# Altium schematic sheet io.SchDoc
size A3
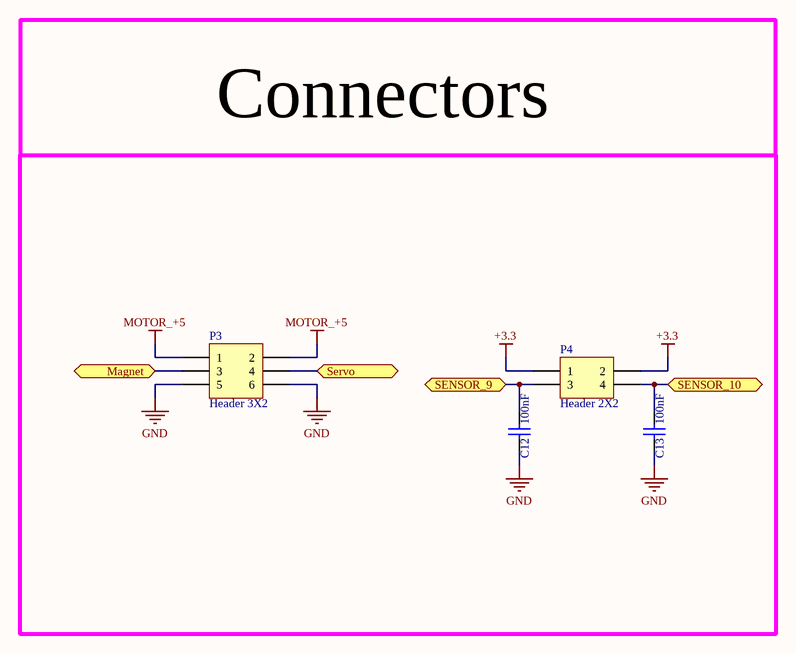
[diagram p0: io.SchDoc]

## Parts
C12  100nF  [CAP_0402i_1005m -N]
C13  100nF  [CAP_0402i_1005m -N]
P3  Header 3X2  [HDR2X3]
P4  Header 2X2  [HDR2X2]

## Ports
Magnet (bidir), SENSOR_9 (bidir), SENSOR_10 (bidir), Servo (bidir)

## Nets
+3.3: P4.1 P4.2
GND: C12.1 C13.1 P3.5 P3.6
MOTOR_+5: P3.1 P3.2
Magnet: P3.3 ; port Magnet
SENSOR_9: C12.2 P4.3 ; port SENSOR_9
SENSOR_10: C13.2 P4.4 ; port SENSOR_10
Servo: P3.4 ; port Servo

## Notes on the sheet
- Connectors
- 1
- 2
- 3
- 4
- 5
- 6
- 7
- 8
- A
- B
- C
- D
- Project:
- Date:
- Drawing number:
- Rev:
- Format:
- A3
- Drawn by:
- Laboratory:
- Page
- Sheet:
- of
- File:

## Library data of the parts
C12 C13 = Cap: capacitor
P3 = Header 3X2: Header, 3-Pin, Dual row
P4 = Header 2X2: Header, 2-Pin, Dual row